# EAGLE design mega pinout (EAGLE 9.6.2)
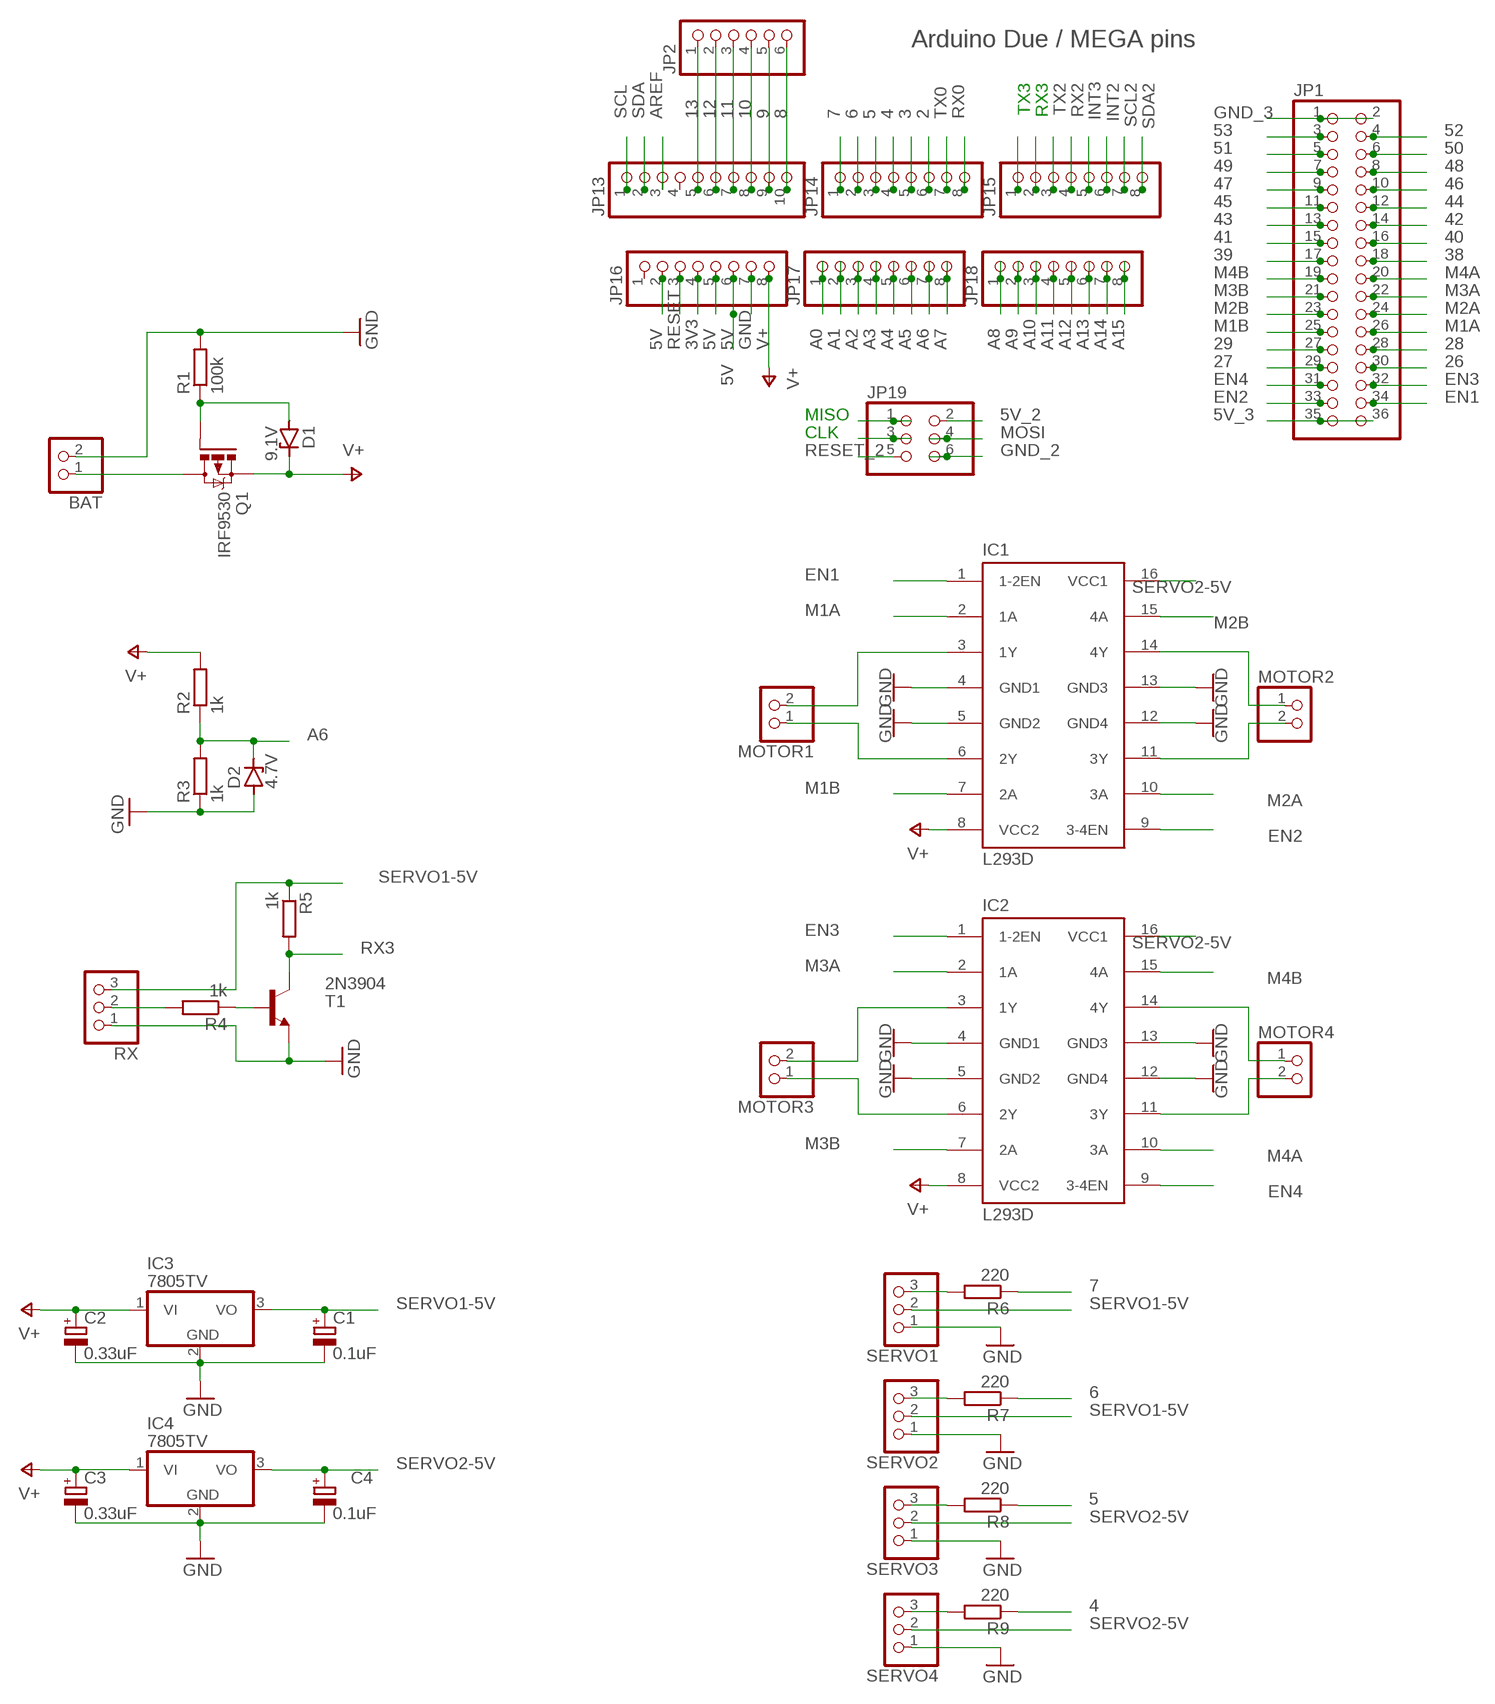
[diagram p0: schematic, sheet 1]

## Parts
BAT  PINHD-1X2  [1X02]
C1  0.1uF  CPOL-EUE2.5-7  [E2,5-7]
C2  0.33uF  CPOL-EUE2.5-7  [E2,5-7]
C3  0.33uF  CPOL-EUE2.5-7  [E2,5-7]
C4  0.1uF  CPOL-EUE2.5-7  [E2,5-7]
D1  9.1V  ZENER-DIODEZD-2.5  [ZDIO-2.5]
D2  4.7V  ZENER-DIODEZD-2.5  [ZDIO-2.5]
IC1  L293D  [DIL16]
IC2  L293D  [DIL16]
IC3  7805TV  [TO220V]
IC4  7805TV  [TO220V]
JP1  PINHD-2X18  [2X18]
JP2  PINHD-1X6  [1X06]
JP13  PINHD-1X10  [1X10]
JP14  PINHD-1X8  [1X08]
JP15  PINHD-1X8  [1X08]
JP16  PINHD-1X8  [1X08]
JP17  PINHD-1X8  [1X08]
JP18  PINHD-1X8  [1X08]
JP19  PINHD-2X3  [2X03]
MOTOR1  PINHD-1X2  [1X02]
MOTOR2  PINHD-1X2  [1X02]
MOTOR3  PINHD-1X2  [1X02]
MOTOR4  PINHD-1X2  [1X02]
Q1  IRF9530  [TO220BV]
R1  100k  R-EU_0207/2V  [0207/2V]
R2  1k  R-EU_0207/2V  [0207/2V]
R3  1k  R-EU_0207/2V  [0207/2V]
R4  1k  R-EU_0207/2V  [0207/2V]
R5  1k  R-EU_0207/2V  [0207/2V]
R6  220  R-EU_0207/2V  [0207/2V]
R7  220  R-EU_0207/2V  [0207/2V]
R8  220  R-EU_0207/2V  [0207/2V]
R9  220  R-EU_0207/2V  [0207/2V]
RX  PINHD-1X3  [1X03]
SERVO1  PINHD-1X3  [1X03]
SERVO2  PINHD-1X3  [1X03]
SERVO3  PINHD-1X3  [1X03]
SERVO4  PINHD-1X3  [1X03]
T1  2N3904  [TO92]

## Nets
2: JP14.6
3: JP14.5
3V3: JP16.4
4: JP14.4 R9.1
5: JP14.3 R8.1
5V: JP16.2 JP16.5 JP16.6
5V_2: JP19.2
5V_3: JP1.35 JP1.36
6: JP14.2 R7.1
7: JP14.1 R6.1
8: JP2.6 JP13.10
9: JP2.5 JP13.9
10: JP2.4 JP13.8
11: JP2.3 JP13.7
12: JP2.2 JP13.6
13: JP2.1 JP13.5
26: JP1.30
27: JP1.29
28: JP1.28
29: JP1.27
38: JP1.18
39: JP1.17
40: JP1.16
41: JP1.15
42: JP1.14
43: JP1.13
44: JP1.12
45: JP1.11
46: JP1.10
47: JP1.9
48: JP1.8
49: JP1.7
50: JP1.6
51: JP1.5
52: JP1.4
53: JP1.3
A0: JP17.1
A1: JP17.2
A2: JP17.3
A3: JP17.4
A4: JP17.5
A5: JP17.6
A6: D2.C JP17.7 R2.1 R3.2
A7: JP17.8
A8: JP18.1
A9: JP18.2
A10: JP18.3
A11: JP18.4
A12: JP18.5
A13: JP18.6
A14: JP18.7
A15: JP18.8
AREF: JP13.3
CLK: JP19.3
EN1: IC1.1(1-2EN) JP1.34
EN2: IC1.9(3-4EN) JP1.33
EN3: IC2.1(1-2EN) JP1.32
EN4: IC2.9(3-4EN) JP1.31
GND: BAT.2 C1.- C2.- C3.- C4.- D2.A IC1.4(GND1) IC1.5(GND2) IC1.12(GND4) IC1.13(GND3) IC2.4(GND1) IC2.12(GND4) IC3.2(GND) IC4.2(GND) JP16.7 R1.2 R3.1 RX.1 SERVO1.1 SERVO2.1 SERVO3.1 SERVO4.1 T1.3(E)
GND_2: JP19.6
GND_3: JP1.1 JP1.2
INT2: JP15.6
INT3: JP15.5
M1A: IC1.2(1A) JP1.26
M1B: IC1.7(2A) JP1.25
M2A: IC1.10(3A) JP1.24
M2B: IC1.15(4A) JP1.23
M3A: IC2.2(1A) JP1.22
M3B: IC2.7(2A) JP1.21
M4A: IC2.10(3A) JP1.20
M4B: IC2.15(4A) JP1.19
MISO: JP19.1
MOSI: JP19.4
MOTOR3: IC2.6(2Y) MOTOR3.1
N$1: IC2.5(GND2) ; supply symbol labelled GND
N$2: IC2.13(GND3) ; supply symbol labelled GND
N$3: IC1.3(1Y) MOTOR1.2
N$4: IC1.6(2Y) MOTOR1.1
N$5: IC1.11(3Y) MOTOR2.2
N$6: IC1.14(4Y) MOTOR2.1
N$7: IC2.3(1Y) MOTOR3.2
N$8: R4.2 RX.2
N$9: IC2.11(3Y) MOTOR4.2
N$11: IC2.14(4Y) MOTOR4.1
N$12: BAT.1 Q1.D
N$13: D1.A Q1.G R1.1
N$14: R4.1 T1.2(B)
N$15: R7.2 SERVO2.3
N$17: R6.2 SERVO1.3
N$19: R8.2 SERVO3.3
N$22: R9.2 SERVO4.3
RESET: JP16.3
RESET_2: JP19.5
RX0: JP14.8
RX2: JP15.4
RX3: JP15.2 R5.2 T1.1(C)
SCL: JP13.1
SCL2: JP15.7
SDA: JP13.2
SDA2: JP15.8
SERVO1-5V: C1.+ IC3.3(VO) R5.1 RX.3 SERVO1.2 SERVO2.2
SERVO2-5V: C4.+ IC1.16(VCC1) IC2.16(VCC1) IC4.3(VO) SERVO3.2 SERVO4.2
TX0: JP14.7
TX2: JP15.3
TX3: JP15.1
V+: C2.+ C3.+ D1.C IC1.8(VCC2) IC2.8(VCC2) IC3.1(VI) IC4.1(VI) JP16.8 Q1.S R2.2
Unconnected: JP13.4 JP16.1

## Notes on the sheet
- Arduino Due / MEGA pins

## Library data of the parts
BAT MOTOR1-MOTOR4 = pinhead:PINHD-1X2: PIN HEADER
C1-C4 = rcl:CPOL-EU: POLARIZED CAPACITOR, European symbol; SPICEPREFIX: C
D1 D2 = diode:ZENER-DIODE: Z-Diode
IC1 IC2 = st-microelectronics:L293D: PUSH-PULL 4 CHANNEL DRIVER; MPN: L293D; OC_FARNELL: 9589619; OC_NEWARK: 56P8249
IC3 IC4 = linear:78*: Positive VOLTAGE REGULATOR Source: http://cache.national.com/ds/LM/LM78L05.pdf http://www.fairchildsemi.com/ds/LM/LM7805.pdf
JP1 = pinhead:PINHD-2X18: PIN HEADER
JP2 = pinhead:PINHD-1X6: PIN HEADER
JP13 = pinhead:PINHD-1X10: PIN HEADER
JP14-JP18 = pinhead:PINHD-1X8: PIN HEADER
JP19 = pinhead:PINHD-2X3: PIN HEADER
Q1 = transistor-power:IRF9530: P-CHANNEL HEXFET POWER-MOS-FET Source: http://www.irf.com/product-info/datasheets/data/irf9530.pdf
R1-R9 = rcl:R-EU_: RESISTOR, European symbol; SPICEPREFIX: R
RX SERVO1-SERVO4 = pinhead:PINHD-1X3: PIN HEADER
T1 = transistor:2N3904: NPN TRANSISTOR

## Net classes
1 vcc: width 0.305 mm

## Board
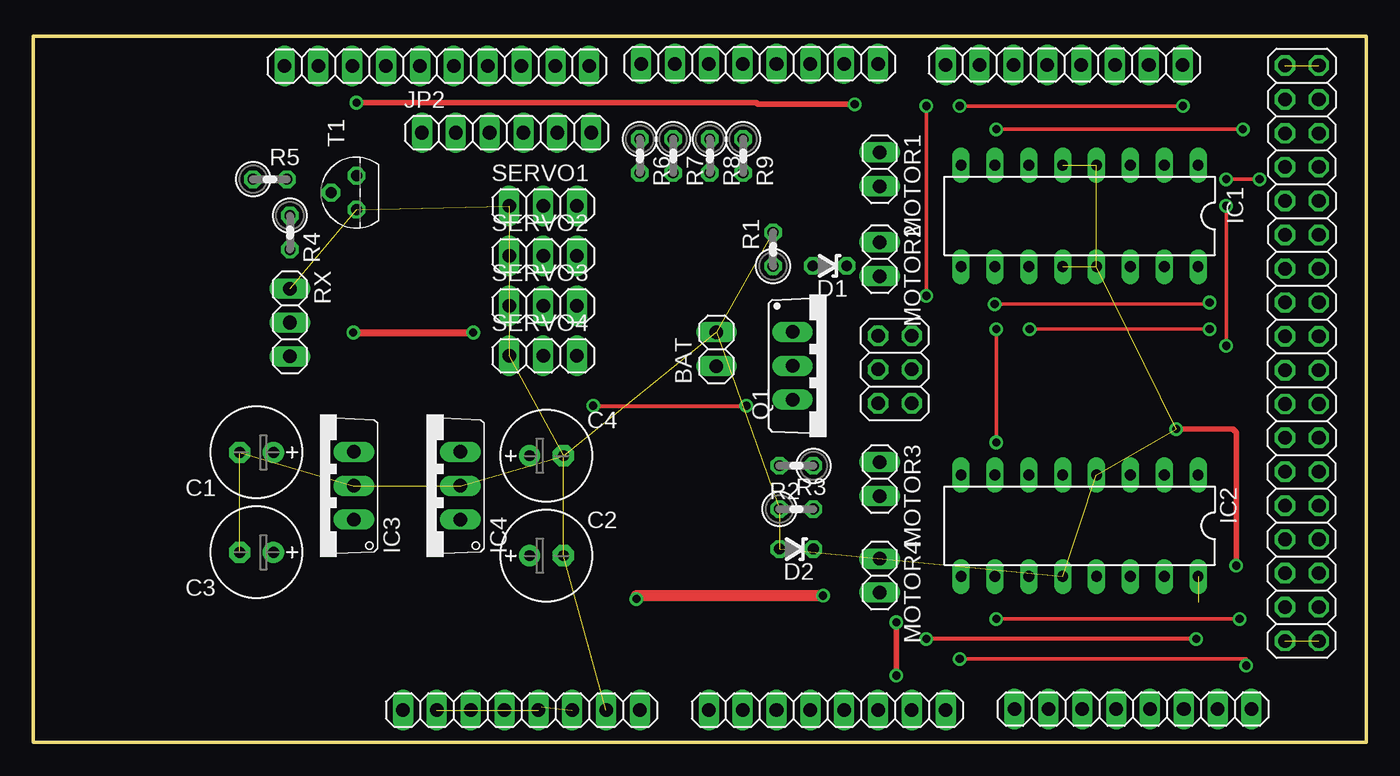
[diagram p1: board, top side]
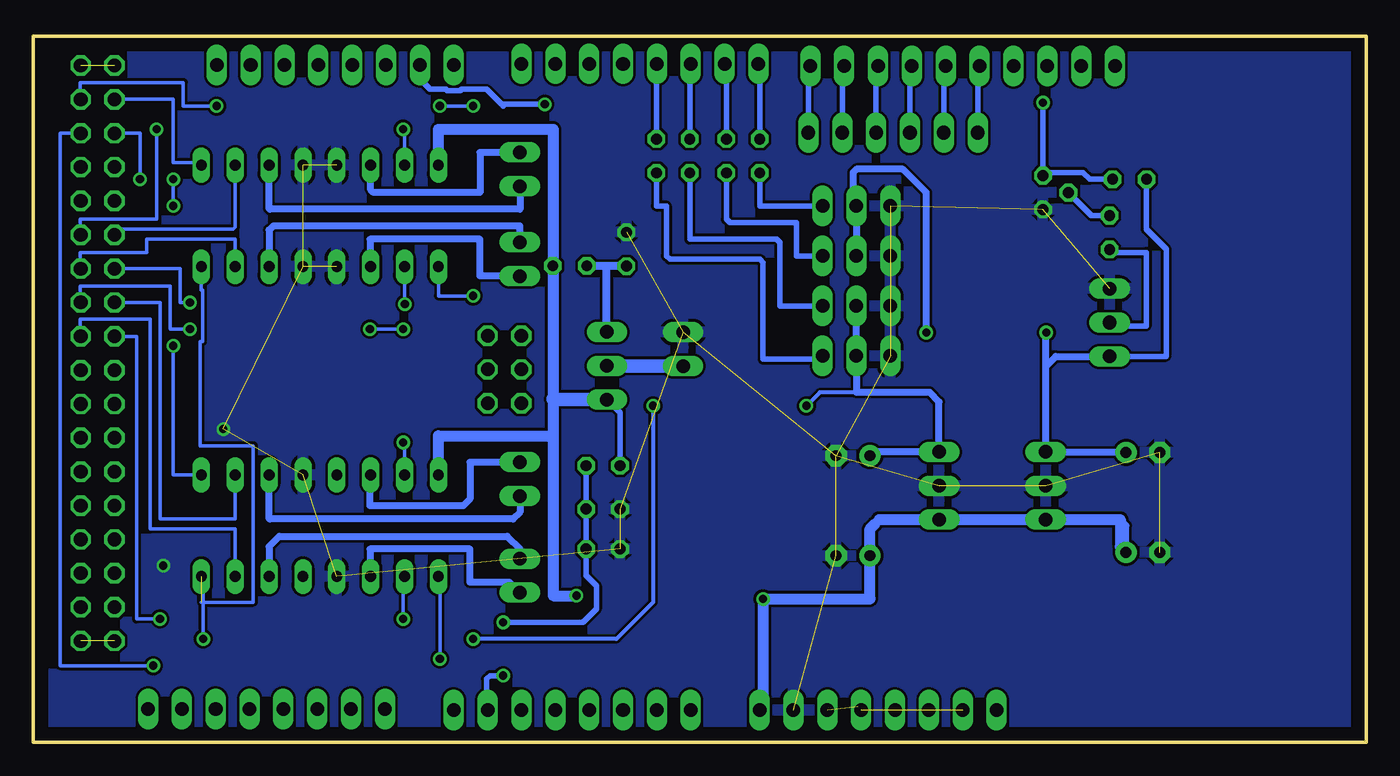
[diagram p2: board, bottom side, seen from below]

Size 100 x 53 mm. Coordinates in mm from the lower left corner, seen from the top.
Outline: 0,0 100,0 100,53 0,53 0,0
Copper layers (1*16): Top 0.035mm / dielectric 1.5mm / Bottom 0.035mm
Design rules "default": minimum track width 10mil, minimum drill 24mil, track to track 8mil, track to pad 8mil, pad to pad 8mil, via to via 8mil, smd to smd 8mil, copper to edge 40mil, drill to drill 8mil, minimum pad ring 10mil, minimum via ring 8mil, stop-mask expansion 4mil, vias tented up to drill 0mil, thermal gap 10mil

### Footprints (pad centres in the part's own frame; a part is rotated, then mirrored left to right if it is on the bottom)
1X02 = drill 1.016 long: 1 -1.27,0; 2 1.27,0
E2,5-7 = drill 0.813 pad 1.6: + -1.27,0 | drill 0.813 pad 1.6 octagon: - 1.27,0
ZDIO-2.5 = drill 0.813 octagon: A 1.27,0; C -1.27,0
DIL16 = drill 0.813 long: 1 -8.89,-3.81; 2 -6.35,-3.81; 3 -3.81,-3.81; 4 -1.27,-3.81; 5 1.27,-3.81; 6 3.81,-3.81; 7 6.35,-3.81; 8 8.89,-3.81; 9 8.89,3.81; 10 6.35,3.81; 11 3.81,3.81; 12 1.27,3.81; 13 -1.27,3.81; 14 -3.81,3.81; 15 -6.35,3.81; 16 -8.89,3.81
TO220V = drill 1.016 long: 1 -2.54,-2.54; 2 0,-2.54; 3 2.54,-2.54
2X18 = drill 1.016 octagon: 1 -21.59,-1.27; 2 -21.59,1.27; 3 -19.05,-1.27; 4 -19.05,1.27; 5 -16.51,-1.27; 6 -16.51,1.27; 7 -13.97,-1.27; 8 -13.97,1.27; 9 -11.43,-1.27; 10 -11.43,1.27; 11 -8.89,-1.27; 12 -8.89,1.27; 13 -6.35,-1.27; 14 -6.35,1.27; 15 -3.81,-1.27; 16 -3.81,1.27; 17 -1.27,-1.27; 18 -1.27,1.27; 19 1.27,-1.27; 20 1.27,1.27; 21 3.81,-1.27; 22 3.81,1.27; 23 6.35,-1.27; 24 6.35,1.27; 25 8.89,-1.27; 26 8.89,1.27; 27 11.43,-1.27; 28 11.43,1.27; 29 13.97,-1.27; 30 13.97,1.27; 31 16.51,-1.27; 32 16.51,1.27; 33 19.05,-1.27; 34 19.05,1.27; 35 21.59,-1.27; 36 21.59,1.27
1X06 = drill 1.016 long: 1 -6.35,0; 2 -3.81,0; 3 -1.27,0; 4 1.27,0; 5 3.81,0; 6 6.35,0
1X10 = drill 1.016 long: 1 -11.43,0; 2 -8.89,0; 3 -6.35,0; 4 -3.81,0; 5 -1.27,0; 6 1.27,0; 7 3.81,0; 8 6.35,0; 9 8.89,0; 10 11.43,0
1X08 = drill 1.016 long: 1 -8.89,0; 2 -6.35,0; 3 -3.81,0; 4 -1.27,0; 5 1.27,0; 6 3.81,0; 7 6.35,0; 8 8.89,0
2X03 = drill 1.016 octagon: 1 -2.54,-1.27; 2 -2.54,1.27; 3 0,-1.27; 4 0,1.27; 5 2.54,-1.27; 6 2.54,1.27
TO220BV = drill 1.016 long: D 0,-2.54; G -2.54,-2.54; S 2.54,-2.54
0207/2V = drill 0.813 octagon: 1 -1.27,0; 2 1.27,0
1X03 = drill 1.016 long: 1 -2.54,0; 2 0,0; 3 2.54,0
TO92 = drill 0.813 octagon: 1 1.27,0; 2 0,1.905; 3 -1.27,0

### Placement (x,y rotation side)
BAT  51.25,29.5 90 top
C1  16.75,21.75 180 top
C2  38.5,14 0 top
C3  16.75,14.25 180 top
C4  38.5,21.5 0 top
D1  59.75,35.75 180 top
D2  57.25,14.5 180 top
IC1  78.5,39.5 180 top
IC2  78.5,16.25 180 top
IC3  21.5,19.25 90 top
IC4  29.5,19.25 90 top
JP1  95.17,29.19 90 top
JP2  35.5,45.75 0 top
JP13  30.27,50.75 0 top
JP14  54.49,50.92 0 top
JP15  77.34,50.83 0 top
JP16  36.62,2.41 0 top
JP17  59.57,2.41 0 top
JP18  82.51,2.49 0 top
JP19  64.65,27.98 90 top
MOTOR1  63.5,43 270 top
MOTOR2  63.5,36.25 270 top
MOTOR3  63.5,19.75 270 top
MOTOR4  63.5,12.5 270 top
Q1  59.5,28.25 270 top
R1  55.5,37 90 top
R2  57.25,20.75 180 top
R3  57.25,17.5 0 top
R4  19.25,38.25 270 top
R5  17.75,42.25 0 top
R6  45.5,44 270 top
R7  48,44 270 top
R8  50.75,44 270 top
R9  53.25,44 270 top
RX  19.25,31.5 270 top
SERVO1  38.25,40.25 0 top
SERVO2  38.25,36.5 0 top
SERVO3  38.25,32.75 0 top
SERVO4  38.25,29 0 top
T1  24.25,41.25 90 top

### Tracks (layer width: path | path; a pad name or v marks a point on that pad's centre or on a via)
4
  Bottom 0.406: R9.1 53.25,50.88 JP14.4
5
  Bottom 0.406: R8.1 50.75,50.84 JP14.3
5V  (2 unrouted)
  Bottom 0.254: JP16.5 38.14,2.66
5V_3  (1 unrouted)
6
  Bottom 0.406: R7.1 48,50.78 JP14.2
7
  Bottom 0.406: R6.1 45.5,50.82 JP14.1
8
  Bottom 0.406: JP2.6 41.85,50.6 JP13.10
9
  Bottom 0.406: JP2.5 39.31,50.6 JP13.9
10
  Bottom 0.406: JP2.4 36.77,50.6 JP13.8
11
  Bottom 0.406: JP2.3 34.23,50.6 JP13.7
12
  Bottom 0.406: JP2.2 31.69,50.19 31.75,50.25 31.75,50.54 JP13.6
13
  Bottom 0.406: JP2.1 29.15,50.6 JP13.5
A6  (via drill 0.61)
  Top 0.406: v64.75,9 v64.75,5
  Bottom 0.406: R2.1 R3.2 D2.C 58.52,12.52 57.75,11.75 57.75,10 58.75,9 v64.75,9 | v64.75,5 65.75,5 66,4.75 66,2.49 JP17.7
EN1
  Bottom 0.254: IC1.1 87.39,43.5 89.5,43.5 89.5,48.25 JP1.34
EN2  (via drill 0.61)
  Top 0.254: v67,33.5 v67,47.75 | v69.5,47.75 v86.25,47.75
  Bottom 0.254: IC1.9 69.61,33.5 v67,33.5 | v86.25,47.75 88.75,47.75 88.75,49.5 96.5,49.5 96.5,48.24 JP1.33 | v67,47.75 v69.5,47.75
EN3  (via drill 0.61)
  Top 0.254: v89.5,29.75 v89.5,40.25 | v89.5,42.25 v92,42.25
  Bottom 0.254: IC2.1 89.5,20.06 v89.5,29.75 | v92,42.25 92,45.7 JP1.32 | v89.5,40.25 v89.5,42.25
EN4  (via drill 0.61)
  Top 0.254: v91,5.75 91,6.25 v69.5,6.25
  Bottom 0.254: JP1.31 98,45.7 98,5.75 v91,5.75 | v69.5,6.25 69.5,12.44 IC2.9
GND  (via drill 0.61)  (23 unrouted)
  Top 0.406: v85.75,23.5 90,23.5 90.25,23.25 v90.25,13.25
  pour Bottom: -2,-1 -2,52.75 0,54.75 100,54.75 102.25,52.5 102.25,0.25 99.75,-2.25 98.75,-1.25 -2,-1.25
GND_3  (1 unrouted)
M1A
  Bottom 0.254: IC1.2 84.85,38.65 85,38.5 93.49,38.5 JP1.26
M1B  (via drill 0.61)
  Top 0.254: v72.25,46 v90.75,46
  Bottom 0.254: IC1.7 72.15,45.65 72.25,45.75 v72.25,46 | v90.75,46 90.75,39.25 96.5,39.25 96.5,38.14 JP1.25
M2A  (via drill 0.61)
  Top 0.254: 72.12,33 v72.12,32.88 88.25,32.88 v88.25,33
  Bottom 0.254: IC1.10 72.15,33.1 72.25,33 v72.12,32.88 | v88.25,33 89,33 89,35.55 JP1.24
M2B
  Bottom 0.254: IC1.15 84.85,37.75 91.5,37.75 91.5,36.75 96.5,36.75 96.5,35.55 JP1.23
M3A
  Bottom 0.254: IC2.2 84.85,16.75 90.5,16.75 90.5,33.01 JP1.22
M3B  (via drill 0.61)
  Top 0.254: v72.25,22.5 v72.25,31 | v74.75,31 v88.25,31
  Bottom 0.254: IC2.7 72.15,22.5 v72.25,22.5 | v72.25,31 v74.75,31 | JP1.21 96.5,33.01 96.5,34.25 89.75,34.25 89.75,31 v88.25,31
M4A  (via drill 0.61)
  Top 0.254: v72.25,9.25 v90.5,9.25
  Bottom 0.254: IC2.10 72.25,12.44 v72.25,9.25 | 94,30.46 JP1.20 92.25,30.46 92.25,9.25 v90.5,9.25
M4B
  Bottom 0.254: IC2.15 84.85,16 91.25,16 91.25,31.75 96.5,31.75 96.5,30.46 JP1.19
MOTOR3
  Bottom 0.508: MOTOR3.1 63.52,21 67.25,21 67.25,18.25 67.75,17.75 74.75,17.75 74.75,20 IC2.6
N$3
  Bottom 0.508: MOTOR1.2 63.5,40 82.25,40 82.31,40.06 IC1.3
N$4
  Bottom 0.508: MOTOR1.1 63.52,44.25 66.5,44.25 66.5,41.25 74.5,41.25 74.69,41.44 IC1.6
N$5
  Bottom 0.508: MOTOR2.2 63.52,35 66.5,35 66.5,37.75 74.75,37.75 74.75,35.75 IC1.11
N$6
  Bottom 0.508: MOTOR2.1 63.5,38.75 82,38.75 82.31,38.44 IC1.14
N$7
  Bottom 0.508: MOTOR3.2 63.5,17.25 64,16.75 82.25,16.75 82.31,16.81 IC2.3
N$8
  Bottom 0.406: R4.2 19.02,36.75 16.5,36.75 16.5,31.25 19,31.25 RX.2
N$9
  Bottom 0.508: MOTOR4.2 64.27,12 67.25,12 67.25,14.5 74.75,14.5 74.75,12.5 IC2.11
N$10
  pour Bottom: 
N$11
  Bottom 0.508: 82.31,12.69 IC2.14 82.31,14.69 81.54,15.46 64.44,15.46 63.5,14.52 MOTOR4.1
N$12
  Bottom 1.016: 51.48,28 BAT.1 56.94,28.23 Q1.D
N$13
  Bottom 0.61: R1.1 55.52,35.75 57,35.75 | 57,35.75 D1.A | Q1.G 57,30.83 57,35.75
N$14
  Bottom 0.406: R4.1 20.61,39.52 T1.2
N$15
  Bottom 0.406: R7.2 48,39.25 47.75,39 42.75,39 42.75,36.5 SERVO2.3
N$17
  Bottom 0.406: SERVO1.3 45.5,40.25 R6.2
N$19
  Bottom 0.406: SERVO3.3 44,32.75 44,37.5 44.25,37.75 50.75,37.75 R8.2
N$22
  Bottom 0.406: R9.2 53.25,40.25 52.5,40.25 52.5,36.5 52.25,36.25 45.5,36.25 45.25,36 45.25,28.75 41.04,28.75 SERVO4.3
RX3  (via drill 0.61)
  Top 0.406: v61.62,47.88 54.38,47.88 54.25,48 v24.25,48
  Bottom 0.406: JP15.2 71,49.74 70.25,49 69.03,49 68.94,48.9 67.97,48.9 67.87,49 66,49 64.88,47.88 | 64.88,47.88 64.75,47.75 | 64.88,47.88 61.88,47.88 61.75,48 v61.62,47.88 | R5.2 20.75,42.25 21.25,42.75 24.02,42.75 T1.1 v24.25,48
SERVO1-5V  (via drill 0.61)
  Top 0.508: v24,30.75 v33,30.75
  Bottom 0.406: RX.3 15.04,28.96 15,29 15,37 16.5,38.5 16.5,42.23 R5.1
  Bottom 0.508: 24.04,28.21 IC3.3 24,21.75 C1.+ | RX.3 23.29,28.96 24.04,28.21 | 24.04,28.21 24.04,30.71 v24,30.75 | v33,30.75 33,41.25 34.75,43 38.25,43 38.5,42.75 38.5,40.5 SERVO1.2 SERVO2.2
SERVO2-5V  (via drill 0.61)  (1 unrouted)
  Top 0.305: v87.25,7.75 v67,7.75 | v42,25.25 v53.5,25.25
  Bottom 0.254: v87.25,7.75 87.25,12.44 IC2.16 | 87.39,10.5 83.5,10.5 83.5,22.25 87.5,22.25 87.5,30.06 87.31,30.06 87.31,33.94 87.39,33.94 IC1.16
  Bottom 0.305: 38.25,26.25 41,26.25 v42,25.25 | v53.5,25.25 53.5,10.5 56.25,7.75 v67,7.75
  Bottom 0.508: SERVO3.2 SERVO4.2 38.25,26.25 32.75,26.25 32.04,25.54 IC4.3 36.94,21.79 C4.+
V+  (via drill 0.61)
  Top 0.813: v59.25,11 45.25,11 v45.25,10.75
  Bottom 0.406: Q1.S 55.98,24.73 R2.2
  Bottom 0.508: C3.+ 18.02,16.27 18.46,16.71 | 36.88,16.38 36.54,16.71
  Bottom 0.61: D1.C 61,35.77 61,37.25
  Bottom 0.813: IC2.8 69.61,23 61,23 | 61,23 61,11 v59.25,11 | IC1.8 69.61,46 61,46 61,37.25 61,25.75 61,23 | JP16.8 45.25,2.41 v45.25,10.75 37.25,10.75 37.23,10.77 C2.+ 37.23,16.02 36.88,16.38 | 36.54,16.71 IC4.1 IC3.1 18.46,16.71 18.46,14.69 C3.+
  Bottom 1.016: Q1.S 60.96,25.71 61,25.75